# Altium schematic sheet ESP32_MICROCONTROLLER.SchDoc
size A; SheetNumber: 1; SheetTotal: 6
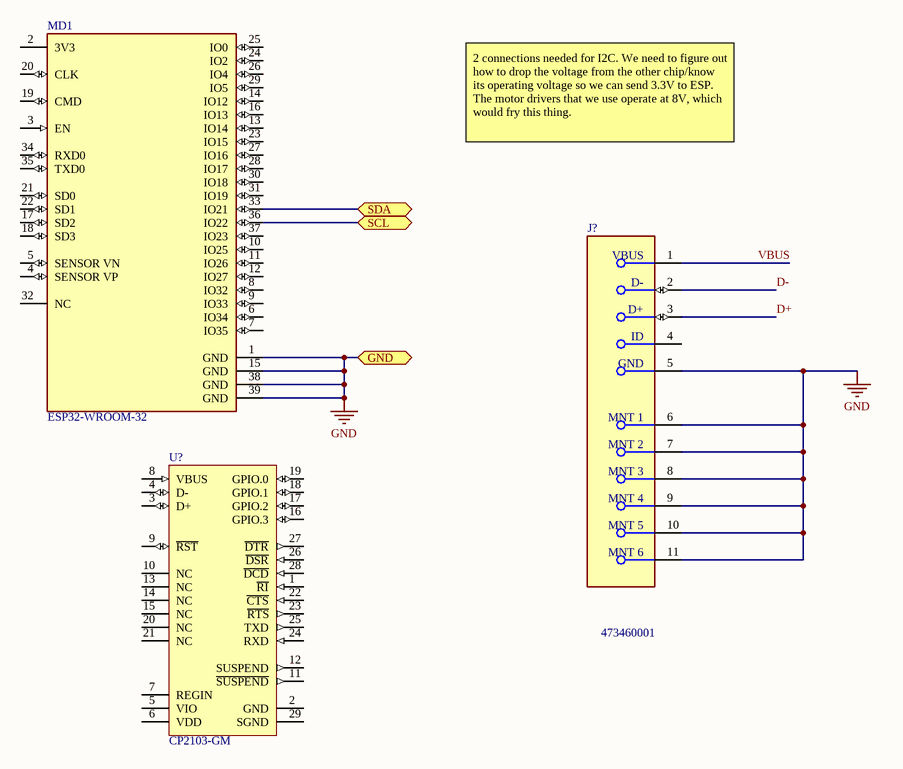
[diagram p0: ESP32_MICROCONTROLLER.SchDoc]

## Parts
J?  473460001  [FP-473460001-MFG]
MD1  ESP32-WROOM-32  [FP-ESP32-WROOM-32-MFG]
U?  CP2103-GM  [SLAB-QFN-28-3125x3125TP_A_M]

## Ports
GND (bidir), SCL (bidir), SDA (bidir)

## Nets
GND: J?.5(GND) J?.6(MNT_1) J?.7(MNT_2) J?.8(MNT_3) J?.9(MNT_4) J?.10(MNT_5) J?.11(MNT_6) MD1.1(GND) MD1.15(GND) MD1.38(GND) MD1.39(GND) ; port GND
D+: J?.3(D+)
D-: J?.2(D-)
SCL: MD1.36(IO22) ; port SCL
SDA: MD1.33(IO21) ; port SDA
VBUS: J?.1(VBUS)

Not connected (* = marked no-connect by the designer): J? 4(ID); MD1 2(3V3) 3(EN) 4(SENSOR_VP) 5(SENSOR_VN) 6(IO34) 7(IO35) 8(IO32) 9(IO33) 10(IO25) 11(IO26) 12(IO27) 13(IO14) 14(IO12) 16(IO13) 17(SD2) 18(SD3) 19(CMD) 20(CLK) 21(SD0) 22(SD1) 23(IO15) 24(IO2) 25(IO0) 26(IO4) 27(IO16) 28(IO17) 29(IO5) 30(IO18) 31(IO19) 32(NC) 34(RXD0) 35(TXD0) 37(IO23); U? 1(~{RI}) 2(GND) 3(D+) 4(D-) 5(VIO) 6(VDD) 7(REGIN) 8(VBUS) 9(~{RST}) 10(NC) 11(~{SUSPEND}) 12(SUSPEND) 13(NC) 14(NC) 15(NC) 16(GPIO.3) 17(GPIO.2) 18(GPIO.1) 19(GPIO.0) 20(NC) 21(NC) 22(~{CTS}) 23(~{RTS}) 24(RXD) 25(TXD) 26(~{DSR}) 27(~{DTR}) 28(~{DCD}) 29(SGND)

## Notes on the sheet
- 2 connections needed for I2C. We need to figure out how to drop the voltage from the other chip/know its operating voltage so we can send 3.3V to ESP. The motor drivers that we use operate at 8V, which would fry this thing.

## Library data of the parts
J? = CMP-2000-05246-2: CONN RCPT USB2.0 MICRO B SMD R/A; Manufacturer: Molex; Conn Orientation: Right Angle; Is Female: yes; Shielding: true; Pitch: 0.65mm; Number Of Contacts: 5; Description: USB - micro B USB 2.0 Receptacle Connector 5 Position Surface Mount, Right Angle; Voltage Rating: 30V; Current Rating: 1.8A; Device Class L2: USB Connectors; Digikey Description: CONN RCPT USB2.0 MICRO B SMD R/A; Height: 2.945mm; RoHS: TRUE; ComponentLink2Description: Datasheet; Octopart: https://octopart.com/47346-0001-molex-7164928; Automotive: No; Package: 0; Category: Conn; Device Class L1: Connectors; Usb Standard: USB 2.0; Temperature: -30°C to +85°C; Temperature Range Low: -30°C; Footprint Url: https://www.molex.com/pdm_docs/sd/473460001_sd.pdf; ComponentLink2URL: https://www.molex.com/webdocs/datasheets/pdf/en-us/0473460001_IO_CONNECTORS.pdf; Lead Free: Yes; Manufacturer Part Number: 473460001; Contact Material: Gold,Nickel; Temperature Range High: +85°C; Device Class L3: unset
MD1 = CMP-194065-000008-1: RX TXRX MOD WIFI SURFACE MOUNT; Frequency: 2.5GHz; Sensitivity: -98dBm; Operating Supply Voltage: 3.6V; Data Rate: 150Mbps; Weight: 0.088185oz; Package Quantity: 550; Min Operating Temperature: -40°C; Mount: Surface Mount; Max Operating Temperature: 85°C; Packaging: Cut Tape; Case/Package: SMD/SMT
U? = CMP-0511-00006-1: Single-Chip USB to UART Bridge, 1024 Bytes EEPROM, -40 to 85 degC, 28-pin QFN, Tube; Manufacturer: Silicon Labs; Internal Oscillator: TRUE; Sub-Family: USB Bridges; PackageDescription: 28-Pin Quad-Flat No-Leads Package, Body 5 x 5 mm, Pitch 0.5 mm; PartNumber: CP2103-GM; ComponentLink2Description: Datasheet; ComponentLink2URL: http://www.silabs.com/Support%20Documents/TechnicalDocs/CP2103.pdf; ComponentLink1URL: http://www.silabs.com/; Mounting Technology: Surface Mount; ComponentLink1Description: Manufacturer URL; PackageReference: QFN-28; EEPROM: 1024 Bytes; DatasheetVersion: Rev. 1.0; ComponentLink3Description: Package Specification; ComponentLink3URL: http://www.silabs.com/Support%20Documents/TechnicalDocs/C8051F35x.pdf